# EAGLE design Status Board 0.4 (EAGLE 8.5.2)
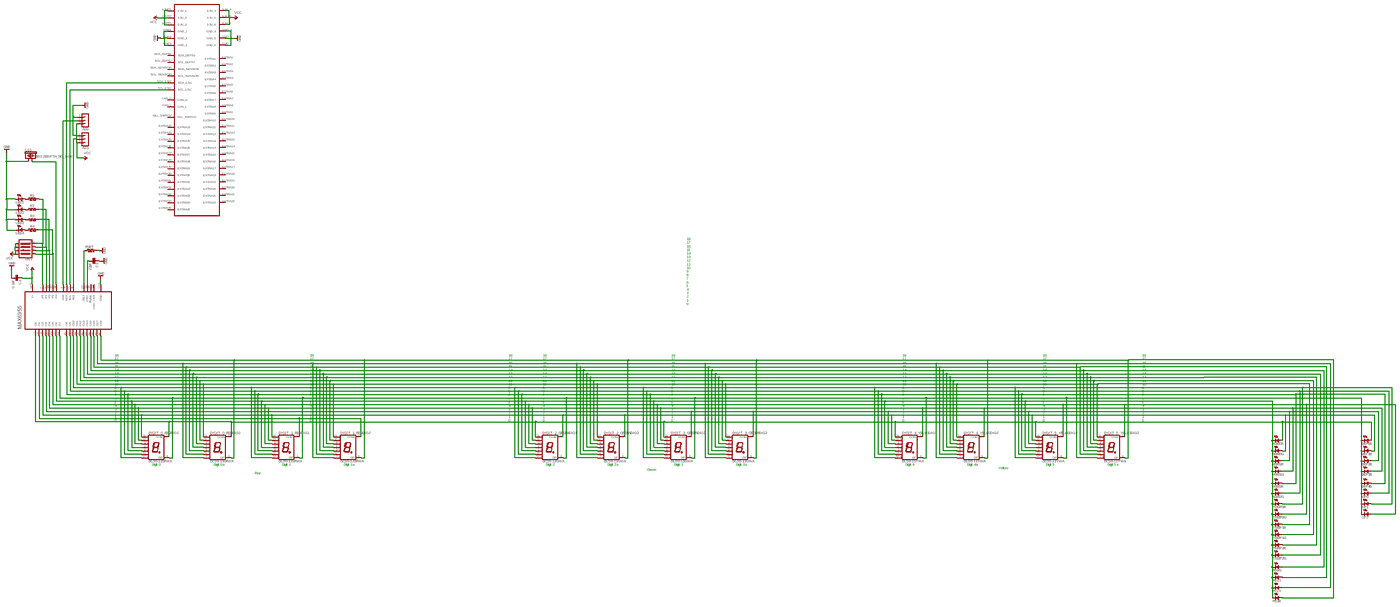
[diagram p0: schematic, sheet 1, overview]
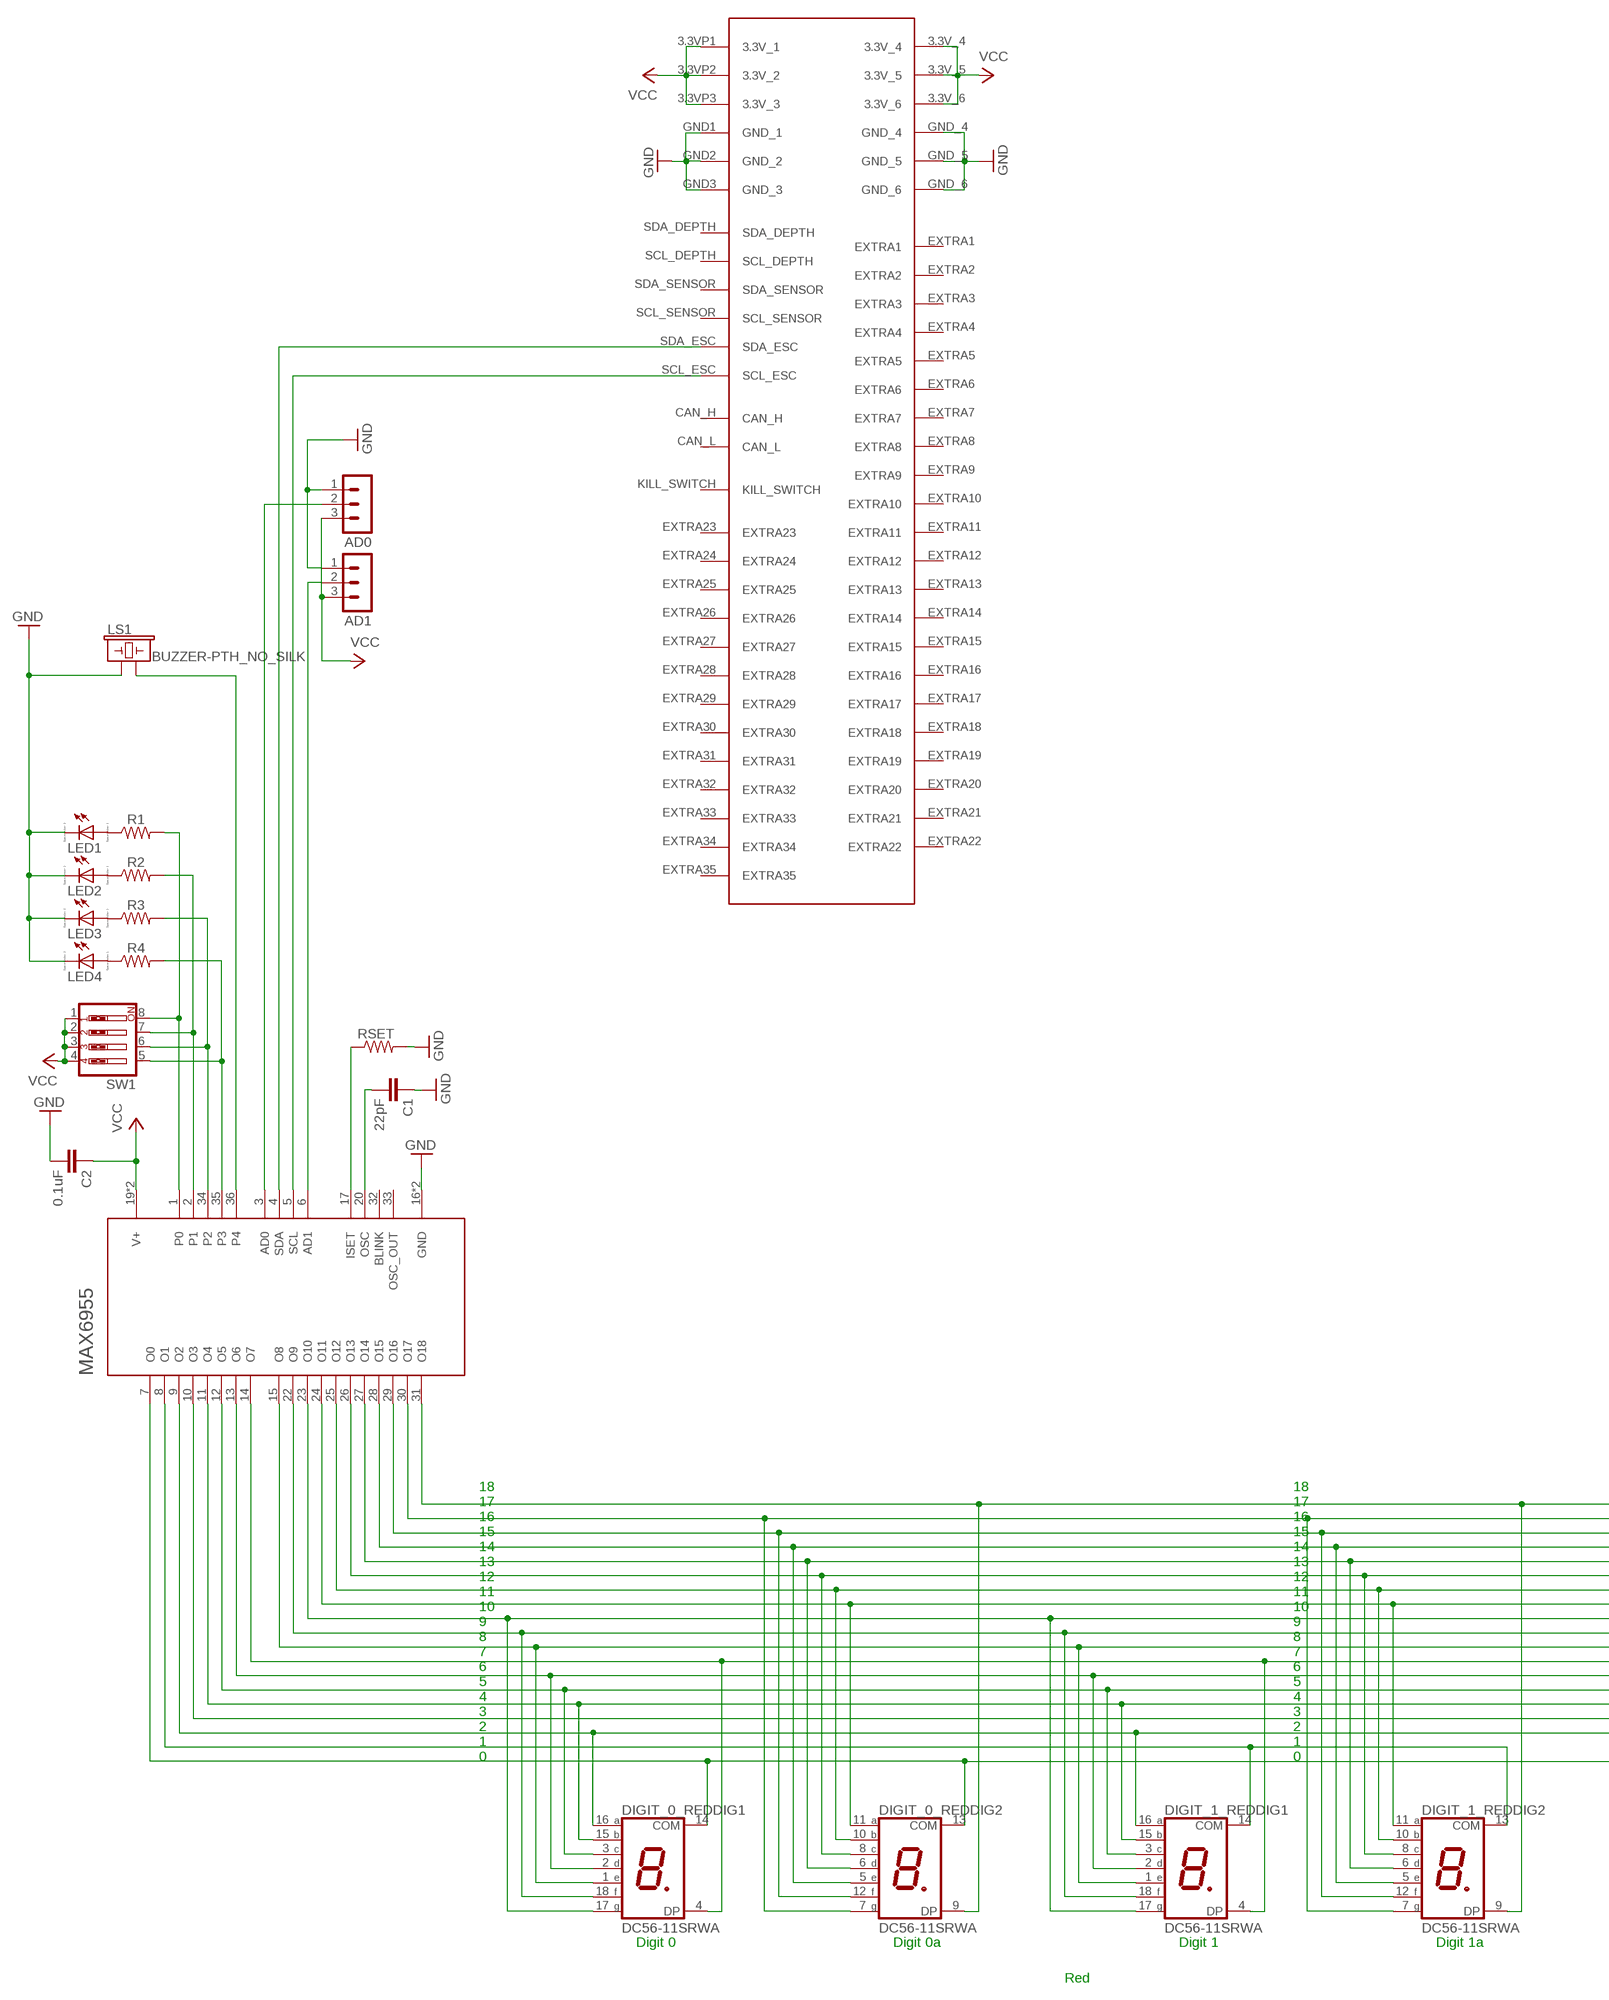
[diagram p1: schematic, sheet 1, part 1 of 4]
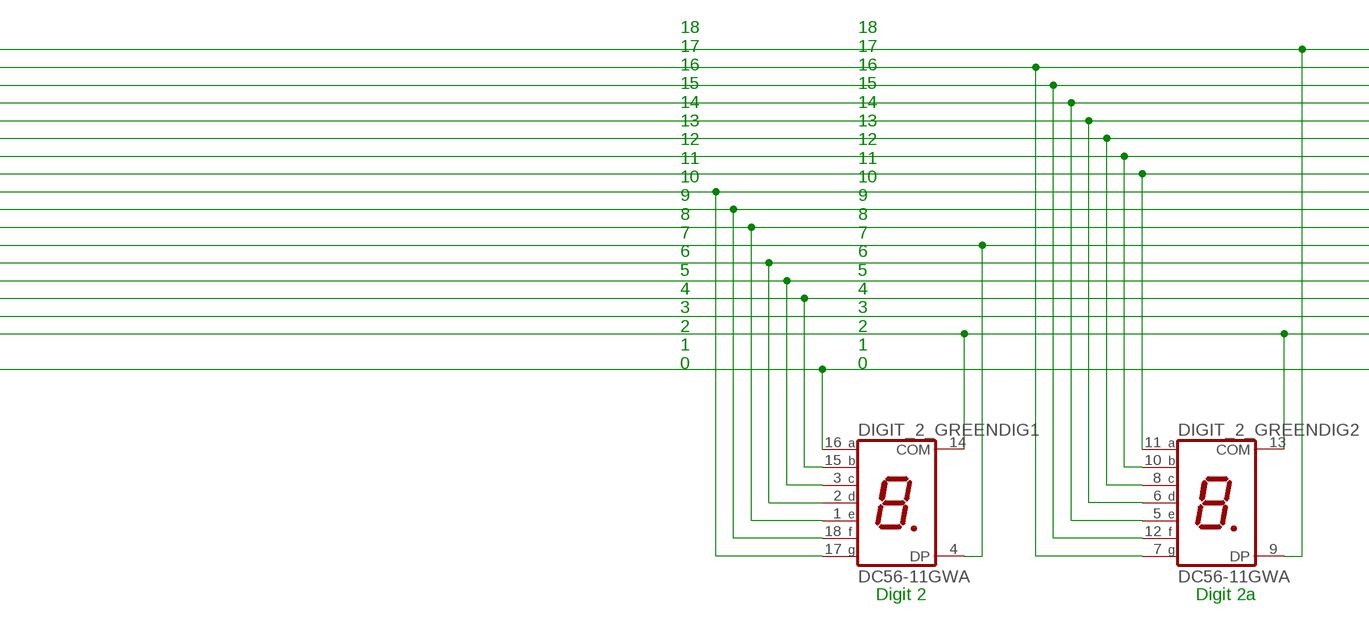
[diagram p2: schematic, sheet 1, part 2 of 4]
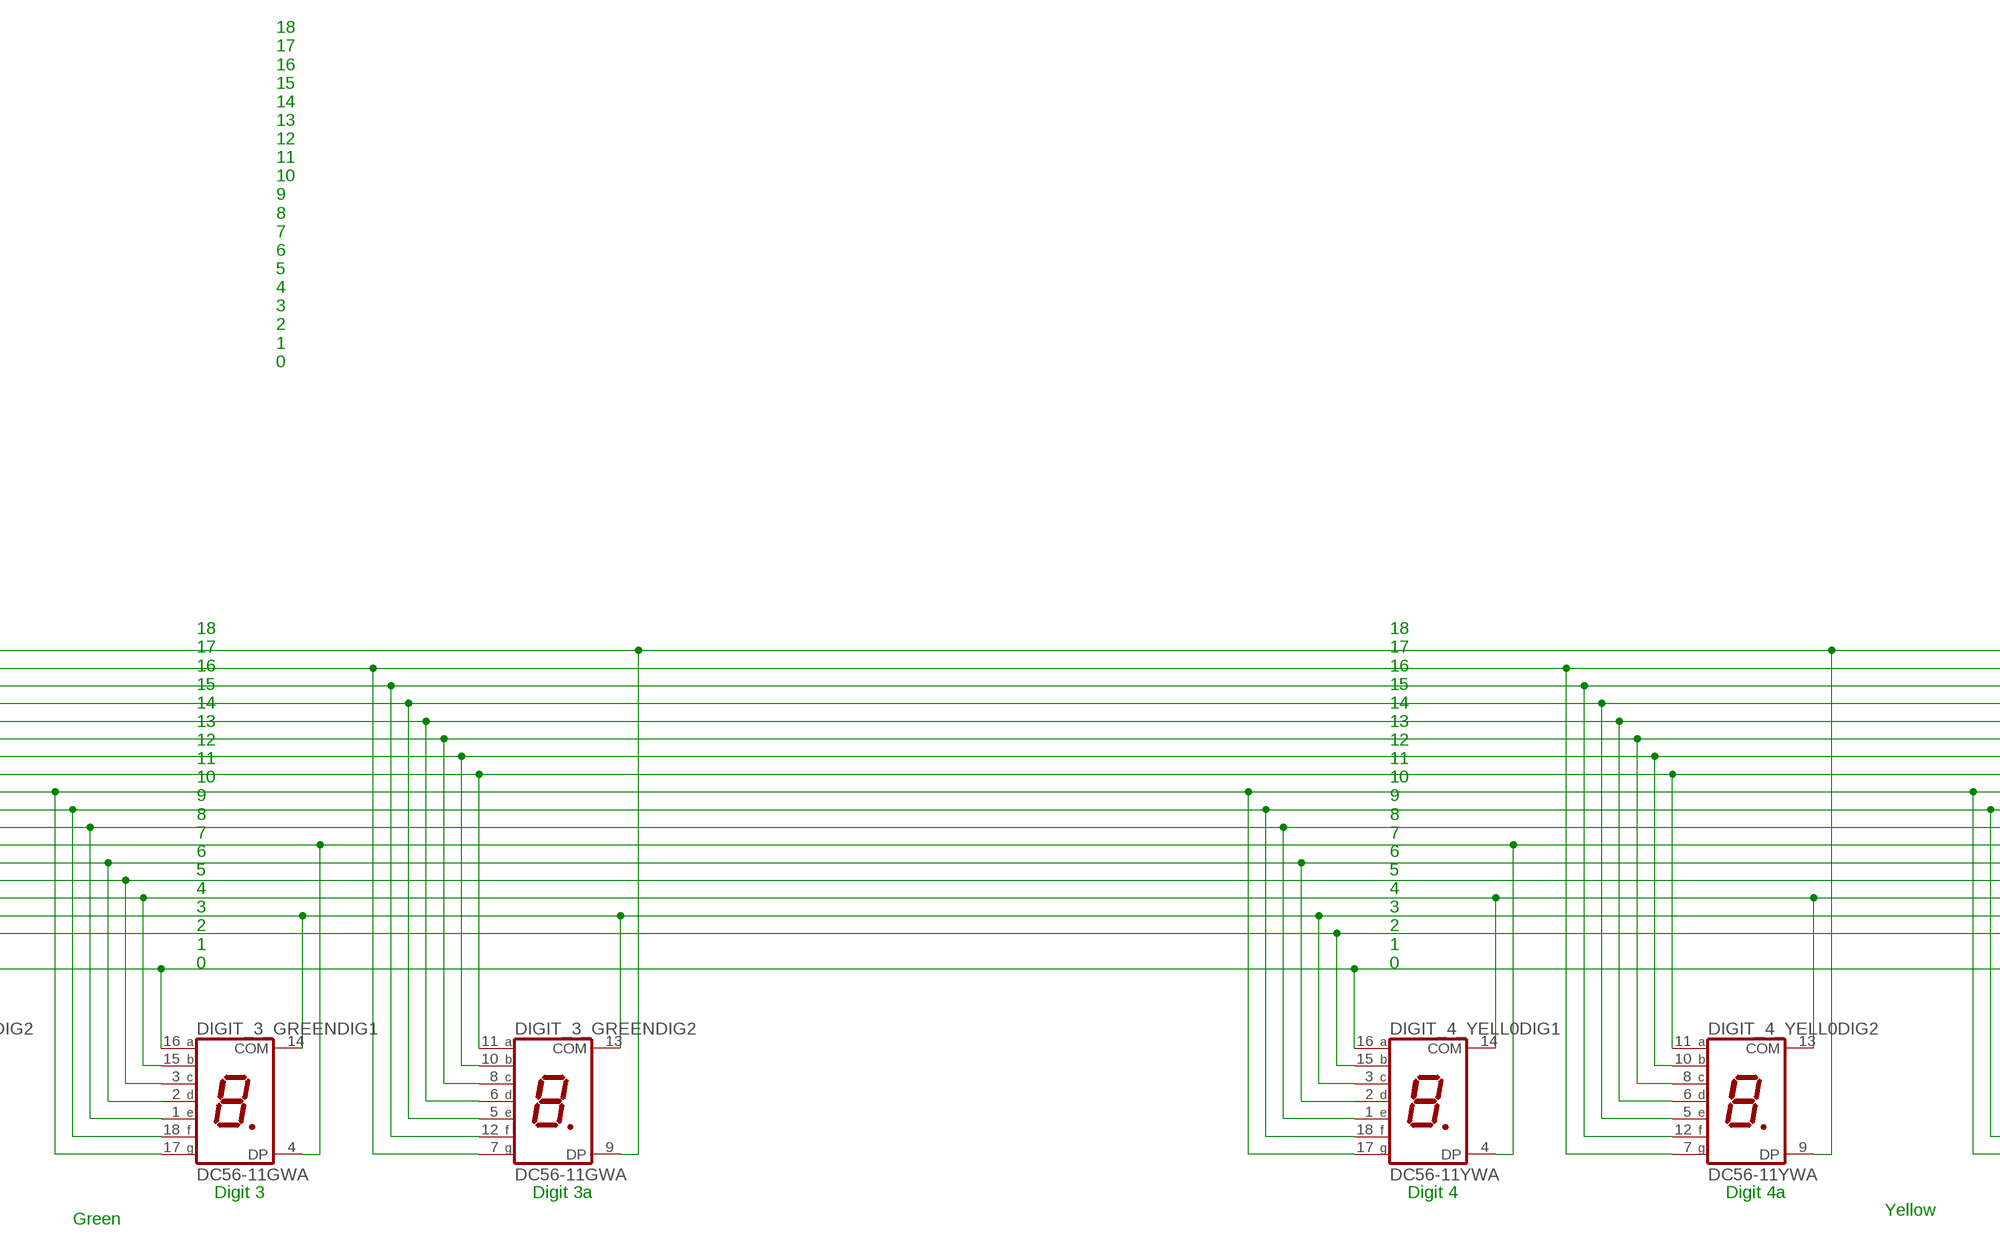
[diagram p3: schematic, sheet 1, part 3 of 4]
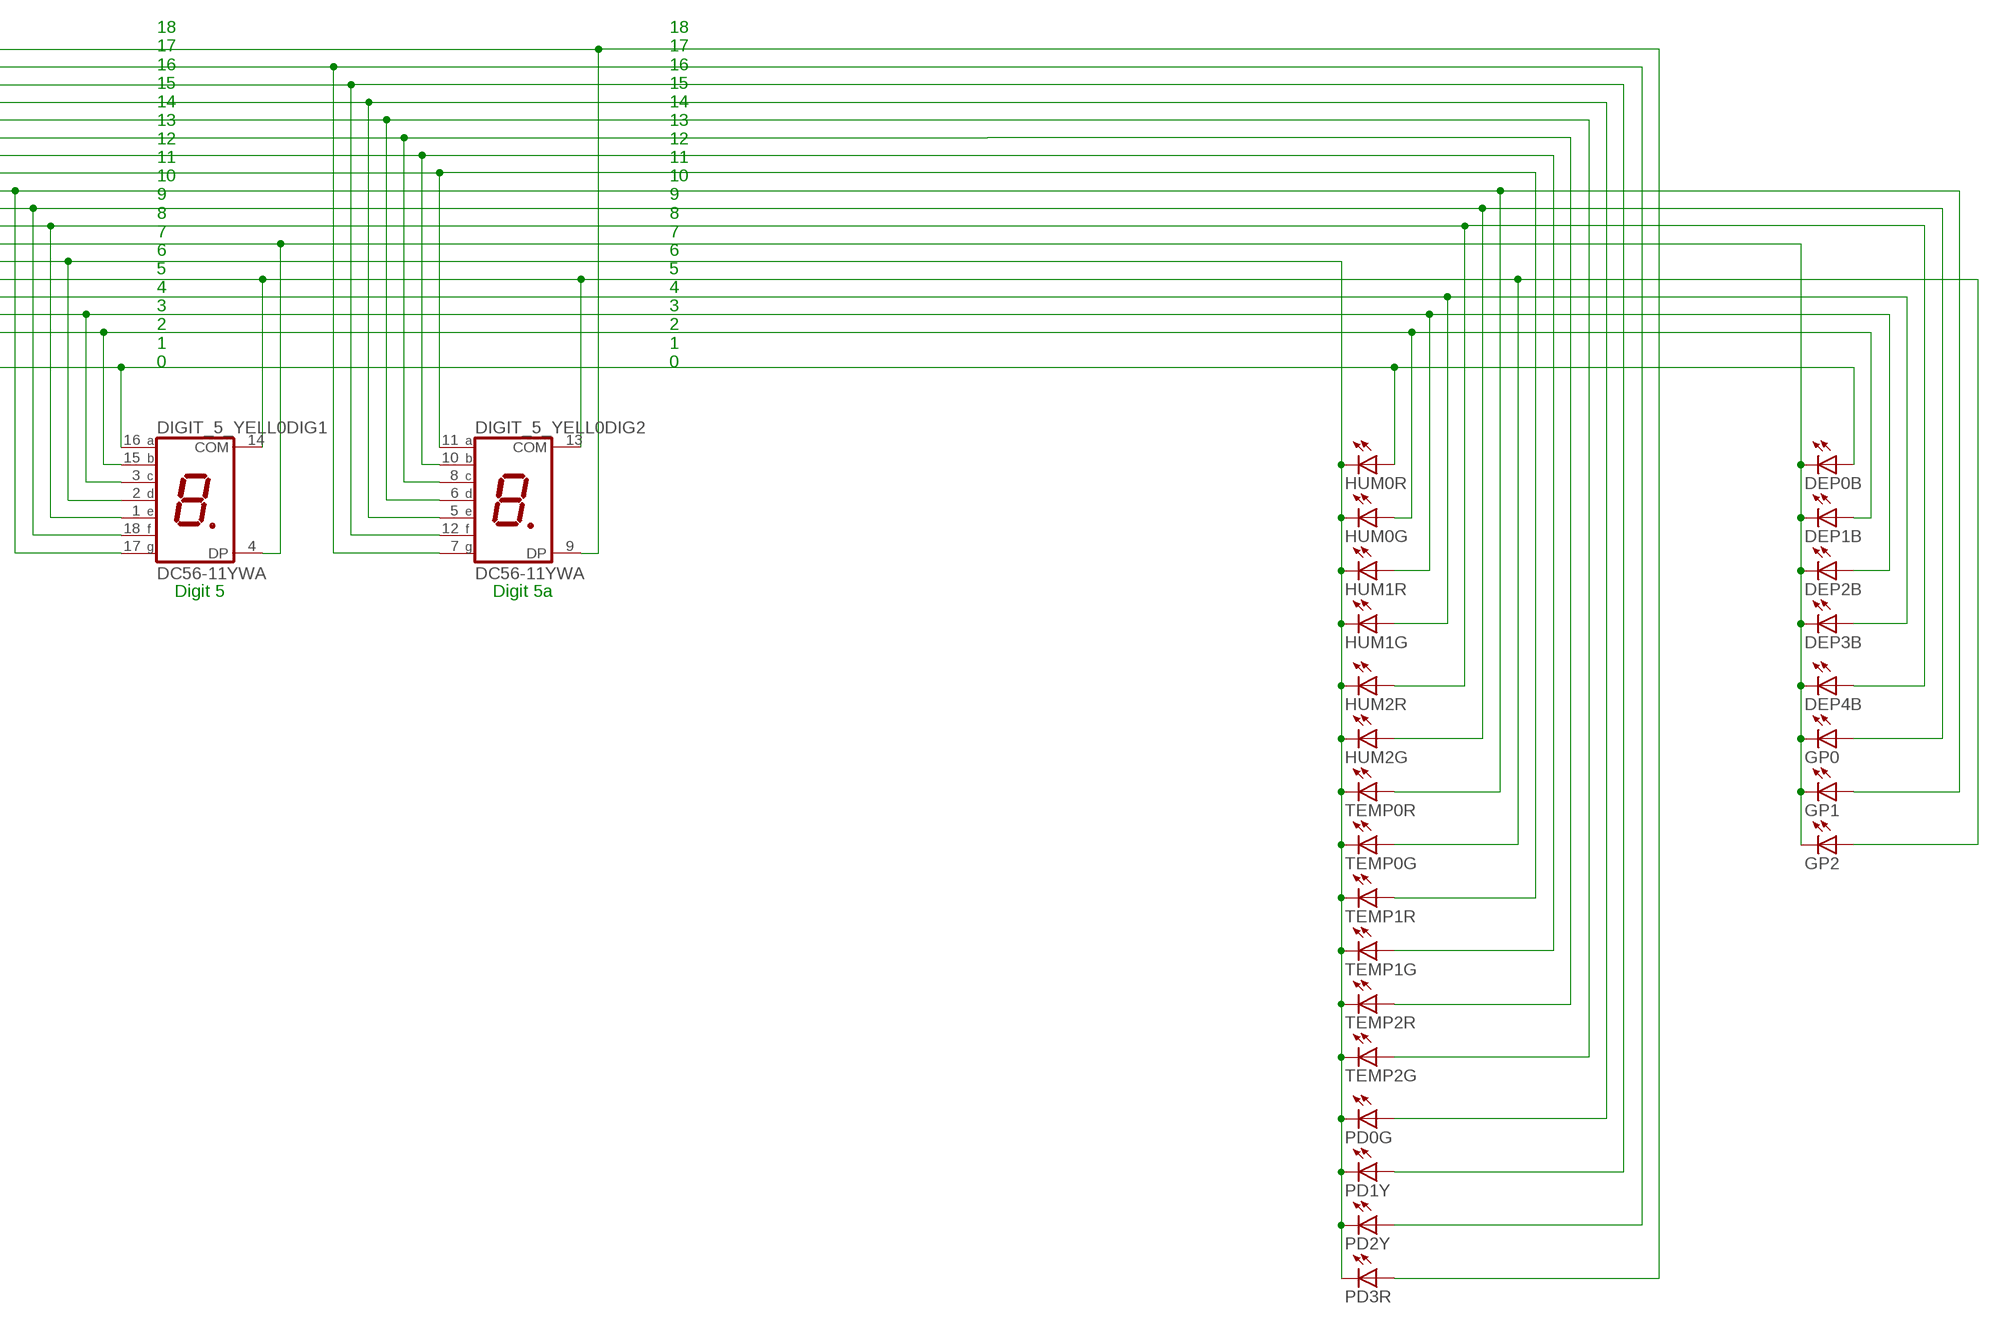
[diagram p4: schematic, sheet 1, part 4 of 4]

## Parts
AD0  MA03-1  [MA03-1]
AD1  MA03-1  [MA03-1]
C1  22pF  22PF-PTH-2.54MM-200V-5%  [CAP-PTH-2.54]
C2  0.1uF  0.1UF-KIT-EZ-50V-20%  [CAP-PTH-SMALL-KIT]
DEP0B  LED3MM  [LED3MM]
DEP1B  LED3MM  [LED3MM]
DEP2B  LED3MM  [LED3MM]
DEP3B  LED3MM  [LED3MM]
DEP4B  LED3MM  [LED3MM]
DIGIT_0_RED  DC56-11SRWA  [DA56]
DIGIT_1_RED  DC56-11SRWA  [DA56]
DIGIT_2_GREEN  DC56-11GWA  [DA56]
DIGIT_3_GREEN  DC56-11GWA  [DA56]
DIGIT_4_YELL0  DC56-11YWA  [DA56]
DIGIT_5_YELL0  DC56-11YWA  [DA56]
GP0  LED3MM  [LED3MM]
GP1  LED3MM  [LED3MM]
GP2  LED3MM  [LED3MM]
HUM0G  LED3MM  [LED3MM]
HUM0R  LED3MM  [LED3MM]
HUM1G  LED3MM  [LED3MM]
HUM1R  LED3MM  [LED3MM]
HUM2G  LED3MM  [LED3MM]
HUM2R  LED3MM  [LED3MM]
LED1  LED_ESML0603  [LED_SML0603]
LED2  LED_ESML0603  [LED_SML0603]
LED3  LED_ESML0603  [LED_SML0603]
LED4  LED_ESML0603  [LED_SML0603]
LS1  BUZZER-PTH_NO_SILK  [BUZZER-12MM-NS]
MAX6955  MAX6955  [SSOP36]
PD0G  LED3MM  [LED3MM]
PD1Y  LED3MM  [LED3MM]
PD2Y  LED3MM  [LED3MM]
PD3R  LED3MM  [LED3MM]
R1  68OHM-0603-1/10W-1%  [0603]
R2  68OHM-0603-1/10W-1%  [0603]
R3  68OHM-0603-1/10W-1%  [0603]
R4  68OHM-0603-1/10W-1%  [0603]
RSET  R-US_0207/12  [0207/12]
SW1  SW_DIP-4  [EDG-04]
TEMP0G  LED3MM  [LED3MM]
TEMP0R  LED3MM  [LED3MM]
TEMP1G  LED3MM  [LED3MM]
TEMP1R  LED3MM  [LED3MM]
TEMP2G  LED3MM  [LED3MM]
TEMP2R  LED3MM  [LED3MM]
U$2  5530843  [5530843-6-BOARDFINGERS]

## Nets
GND: AD0.1 AD1.1 C1.1 C2.2 LED1.C LED2.C LED3.C LED4.C LS1.+ MAX6955.16(GND) MAX6955.18(GND) RSET.2 U$2.GND1(GND_1) U$2.GND2(GND_2) U$2.GND3(GND_3) U$2.GND_4 U$2.GND_5 U$2.GND_6
N$1: LED1.A R1.1
N$2: MAX6955.5(SCL) U$2.SCL_ESC
N$3: LED2.A R2.1
N$4: MAX6955.1(P0) R1.2 SW1.8
N$5: MAX6955.2(P1) R2.2 SW1.7
N$6: MAX6955.34(P2) R3.2 SW1.6
N$7: MAX6955.35(P3) R4.2 SW1.5
N$8: LS1.- MAX6955.36(P4)
N$9: LED3.A R3.1
N$10: LED4.A R4.1
N$11: AD0.2 MAX6955.3(AD0)
N$12: AD1.2 MAX6955.6(AD1)
N$13: C1.2 MAX6955.20(OSC)
N$15: DEP4B.A DIGIT_0_RED.1(DIG1:E) DIGIT_1_RED.1(DIG1:E) DIGIT_2_GREEN.1(DIG1:E) DIGIT_3_GREEN.1(DIG1:E) DIGIT_4_YELL0.1(DIG1:E) DIGIT_5_YELL0.1(DIG1:E) HUM2R.A MAX6955.15(O8)
N$20: DEP0B.A DIGIT_0_RED.13(DIG2:COM) DIGIT_0_RED.14(DIG1:COM) DIGIT_2_GREEN.16(DIG1:A) DIGIT_3_GREEN.16(DIG1:A) DIGIT_4_YELL0.16(DIG1:A) DIGIT_5_YELL0.16(DIG1:A) HUM0R.A MAX6955.7(O0)
N$21: DIGIT_1_RED.13(DIG2:COM) DIGIT_1_RED.14(DIG1:COM) MAX6955.8(O1)
N$22: DEP1B.A DIGIT_0_RED.16(DIG1:A) DIGIT_1_RED.16(DIG1:A) DIGIT_2_GREEN.13(DIG2:COM) DIGIT_2_GREEN.14(DIG1:COM) DIGIT_4_YELL0.15(DIG1:B) DIGIT_5_YELL0.15(DIG1:B) HUM0G.A MAX6955.9(O2)
N$23: DEP2B.A DIGIT_3_GREEN.13(DIG2:COM) DIGIT_3_GREEN.14(DIG1:COM) DIGIT_4_YELL0.3(DIG1:C) DIGIT_5_YELL0.3(DIG1:C) HUM1R.A MAX6955.10(O3)
N$26: DEP3B.A DIGIT_0_RED.15(DIG1:B) DIGIT_1_RED.15(DIG1:B) DIGIT_2_GREEN.15(DIG1:B) DIGIT_3_GREEN.15(DIG1:B) DIGIT_4_YELL0.13(DIG2:COM) DIGIT_4_YELL0.14(DIG1:COM) HUM1G.A MAX6955.11(O4)
N$27: DIGIT_0_RED.3(DIG1:C) DIGIT_1_RED.3(DIG1:C) DIGIT_2_GREEN.3(DIG1:C) DIGIT_3_GREEN.3(DIG1:C) DIGIT_5_YELL0.13(DIG2:COM) DIGIT_5_YELL0.14(DIG1:COM) GP2.A MAX6955.12(O5) TEMP0G.A
N$29: DIGIT_0_RED.18(DIG1:F) DIGIT_1_RED.18(DIG1:F) DIGIT_2_GREEN.18(DIG1:F) DIGIT_3_GREEN.18(DIG1:F) DIGIT_4_YELL0.18(DIG1:F) DIGIT_5_YELL0.18(DIG1:F) GP0.A HUM2G.A MAX6955.22(O9)
N$30: DIGIT_0_RED.17(DIG1:G) DIGIT_1_RED.17(DIG1:G) DIGIT_2_GREEN.17(DIG1:G) DIGIT_3_GREEN.17(DIG1:G) DIGIT_4_YELL0.17(DIG1:G) DIGIT_5_YELL0.17(DIG1:G) GP1.A MAX6955.23(O10) TEMP0R.A
N$31: DIGIT_0_RED.11(DIG2:A) DIGIT_1_RED.11(DIG2:A) DIGIT_2_GREEN.11(DIG2:A) DIGIT_3_GREEN.11(DIG2:A) DIGIT_4_YELL0.11(DIG2:A) DIGIT_5_YELL0.11(DIG2:A) MAX6955.24(O11) TEMP1R.A
N$32: DIGIT_0_RED.10(DIG2:B) DIGIT_1_RED.10(DIG2:B) DIGIT_2_GREEN.10(DIG2:B) DIGIT_3_GREEN.10(DIG2:B) DIGIT_4_YELL0.10(DIG2:B) DIGIT_5_YELL0.10(DIG2:B) MAX6955.25(O12) TEMP1G.A
N$33: DIGIT_0_RED.2(DIG1:D) DIGIT_1_RED.2(DIG1:D) DIGIT_2_GREEN.2(DIG1:D) DIGIT_3_GREEN.2(DIG1:D) DIGIT_4_YELL0.2(DIG1:D) DIGIT_5_YELL0.2(DIG1:D) HUM0G.K(C) HUM0R.K(C) HUM1G.K(C) HUM1R.K(C) HUM2G.K(C) HUM2R.K(C) MAX6955.13(O6) PD0G.K(C) PD1Y.K(C) PD2Y.K(C) PD3R.K(C) TEMP0G.K(C) TEMP0R.K(C) TEMP1G.K(C) TEMP1R.K(C) TEMP2G.K(C) TEMP2R.K(C)
N$34: DIGIT_0_RED.6(DIG2:D) DIGIT_1_RED.6(DIG2:D) DIGIT_2_GREEN.6(DIG2:D) DIGIT_3_GREEN.6(DIG2:D) DIGIT_4_YELL0.6(DIG2:D) DIGIT_5_YELL0.6(DIG2:D) MAX6955.27(O14) TEMP2G.A
N$35: DIGIT_0_RED.5(DIG2:E) DIGIT_1_RED.5(DIG2:E) DIGIT_2_GREEN.5(DIG2:E) DIGIT_3_GREEN.5(DIG2:E) DIGIT_4_YELL0.5(DIG2:E) DIGIT_5_YELL0.5(DIG2:E) MAX6955.28(O15) PD0G.A
N$36: DIGIT_0_RED.12(DIG2:F) DIGIT_1_RED.12(DIG2:F) DIGIT_2_GREEN.12(DIG2:F) DIGIT_3_GREEN.12(DIG2:F) DIGIT_4_YELL0.12(DIG2:F) DIGIT_5_YELL0.12(DIG2:F) MAX6955.29(O16) PD1Y.A
N$37: DIGIT_0_RED.7(DIG2:G) DIGIT_1_RED.7(DIG2:G) DIGIT_2_GREEN.7(DIG2:G) DIGIT_3_GREEN.7(DIG2:G) DIGIT_4_YELL0.7(DIG2:G) DIGIT_5_YELL0.7(DIG2:G) MAX6955.30(O17) PD2Y.A
N$38: DIGIT_0_RED.9(DIG2:DP) DIGIT_1_RED.9(DIG2:DP) DIGIT_2_GREEN.9(DIG2:DP) DIGIT_3_GREEN.9(DIG2:DP) DIGIT_4_YELL0.9(DIG2:DP) DIGIT_5_YELL0.9(DIG2:DP) MAX6955.31(O18) PD3R.A
N$40: DIGIT_0_RED.8(DIG2:C) DIGIT_1_RED.8(DIG2:C) DIGIT_2_GREEN.8(DIG2:C) DIGIT_3_GREEN.8(DIG2:C) DIGIT_4_YELL0.8(DIG2:C) DIGIT_5_YELL0.8(DIG2:C) MAX6955.26(O13) TEMP2R.A
N$43: MAX6955.4(SDA) U$2.SDA_ESC
N$46: MAX6955.17(ISET) RSET.1
N$56: DEP0B.K(C) DEP1B.K(C) DEP2B.K(C) DEP3B.K(C) DEP4B.K(C) DIGIT_0_RED.4(DIG1:DP) DIGIT_1_RED.4(DIG1:DP) DIGIT_2_GREEN.4(DIG1:DP) DIGIT_3_GREEN.4(DIG1:DP) DIGIT_4_YELL0.4(DIG1:DP) DIGIT_5_YELL0.4(DIG1:DP) GP0.K(C) GP1.K(C) GP2.K(C) MAX6955.14(O7)
VCC: AD0.3 AD1.3 C2.1 MAX6955.19(V+) MAX6955.21(V+) SW1.1 SW1.2 SW1.3 SW1.4 U$2.3.3V_4 U$2.3.3V_5 U$2.3.3V_6 U$2.3.3VP1(3.3V_1) U$2.3.3VP2(3.3V_2) U$2.3.3VP3(3.3V_3)
Unconnected: MAX6955.32(BLINK) MAX6955.33(OSC_OUT) U$2.CAN_H U$2.CAN_L U$2.EXTRA1 U$2.EXTRA2 U$2.EXTRA3 U$2.EXTRA4 U$2.EXTRA5 U$2.EXTRA6 U$2.EXTRA7 U$2.EXTRA8 U$2.EXTRA9 U$2.EXTRA10 U$2.EXTRA11 U$2.EXTRA12 U$2.EXTRA13 U$2.EXTRA14 U$2.EXTRA15 U$2.EXTRA16 U$2.EXTRA17 U$2.EXTRA18 U$2.EXTRA19 U$2.EXTRA20 U$2.EXTRA21 U$2.EXTRA22 U$2.EXTRA23 U$2.EXTRA24 U$2.EXTRA25 U$2.EXTRA26 U$2.EXTRA27 U$2.EXTRA28 U$2.EXTRA29 U$2.EXTRA30 U$2.EXTRA31 U$2.EXTRA32 U$2.EXTRA33 U$2.EXTRA34 U$2.EXTRA35 U$2.KILL_SWITCH U$2.SCL_DEPTH U$2.SCL_SENSOR U$2.SDA_DEPTH U$2.SDA_SENSOR

## Notes on the sheet
- 18
  17
  16
  15
  14
  13
  12
  11
  10
  9
  8
  7
  6
  5
  4
  3
  2
  1
  0
- 18
  17
  16
  15
  14
  13
  12
  11
  10
  9
  8
  7
  6
  5
  4
  3
  2
  1
  0
- 18
  17
  16
  15
  14
  13
  12
  11
  10
  9
  8
  7
  6
  5
  4
  3
  2
  1
  0
- 18
  17
  16
  15
  14
  13
  12
  11
  10
  9
  8
  7
  6
  5
  4
  3
  2
  1
  0
- 18
  17
  16
  15
  14
  13
  12
  11
  10
  9
  8
  7
  6
  5
  4
  3
  2
  1
  0
- 18
  17
  16
  15
  14
  13
  12
  11
  10
  9
  8
  7
  6
  5
  4
  3
  2
  1
  0
- 18
  17
  16
  15
  14
  13
  12
  11
  10
  9
  8
  7
  6
  5
  4
  3
  2
  1
  0
- 18
  17
  16
  15
  14
  13
  12
  11
  10
  9
  8
  7
  6
  5
  4
  3
  2
  1
  0
- 18
  17
  16
  15
  14
  13
  12
  11
  10
  9
  8
  7
  6
  5
  4
  3
  2
  1
  0
- Digit 0 | Digit 0a | Digit 1 | Digit 1a | Digit 2 | Digit 2a | Digit 3 | Digit 3a | Digit 4 | Digit 4a | Digit 5 | Digit 5a
- Yellow
- Green
- Red

## Library data of the parts
AD0 AD1 = con-lstb:MA03-1: PIN HEADER; OC_FARNELL: unknown; OC_NEWARK: unknown
C1 = SparkFun-Capacitors:22PF: 22pF ceramic capacitors A capacitor is a passive two-terminal electrical component used to store electrical energy temporarily in an electric field.; PROD_ID: CAP-09128
C2 = SparkFun-Capacitors:0.1UF: 0.1µF ceramic capacitors A capacitor is a passive two-terminal electrical component used to store electrical energy temporarily in an electric field.; PROD_ID: CAP-08370
DEP0B DEP1B DEP2B DEP3B DEP4B GP0 GP1 GP2 HUM0G HUM0R HUM1G HUM1R HUM2G HUM2R PD0G PD1Y PD2Y PD3R TEMP0G TEMP0R TEMP1G TEMP1R TEMP2G TEMP2R = led:LED: LED OSRAM: - CHIPLED LG R971, LG N971, LY N971, LG Q971, LY Q971, LO R971, LY R971 LH N974, LH R974 LS Q976, LO Q976, LY Q976 LO Q996 - Hyper CHIPLED LW Q18S LB Q993, LB Q99A, LB R99A - SideLED LS A670, LO A670, LY A670, LG A670, LP A670 LB A673, LV A673, LT A673, LW A673 LH A674 LY A675 LS A676, LA A676, LO A676, LY A676, LW A676 LS A679, LY A679, LG A679 - Hyper Micro SIDELED® LS Y876, LA Y876, LO Y876, LY Y876 LT Y87S - SmartLED LW L88C, LW L88S LB L89C, LB L89S, LG L890 LS L89K, LO L89K, LY L89K LS L896, LA L896, LO L896, LY L896 - TOPLED LS T670, LO T670, LY T670, LG T670, LP T670 LSG T670, LSP T670, LSY T670, LOP T670, LYG T670 LG T671, LOG T671, LSG T671 LB T673, LV T673, LT T673, LW T673 LH T674 LS T676, LA T676, LO T676, LY T676, LB T676, LH T676, LSB T676, LW T676 LB T67C, LV T67C, LT T67C, LS T67K, LO T67K, LY T67K, LW E67C LS E67B, LA E67B, LO E67B, LY E67B, LB E67C, LV E67C, LT E67C LW T67C LS T679, LY T679, LG T679 LS T770, LO T770, LY T770, LG T770, LP T770 LB T773, LV T773, LT T773, LW T773 LH T774 LS E675, LA E675, LY E675, LS T675 LS T776, LA T776, LO T776, LY T776, LB T776 LHGB T686 LT T68C, LB T68C - Hyper Mini TOPLED® LB M676 - Mini TOPLED Santana® LG M470 LS M47K, LO M47K, LY M47K Source: http://www.osram.convergy.de LUXEON: - LUMILED® LXK2-PW12-R00, LXK2-PW12-S00, LXK2-PW14-U00, LXK2-PW14-V00 LXK2-PM12-R00, LXK2-PM12-S00, LXK2-PM14-U00 LXK2-PE12-Q00, LXK2-PE12-R00, LXK2-PE12-S00, LXK2-PE14-T00, LXK2-PE14-U00 LXK2-PB12-K00, LXK2-PB12-L00, LXK2-PB12-M00, LXK2-PB14-N00, LXK2-PB14-P00, LXK2-PB14-Q00 LXK2-PR12-L00, LXK2-PR12-M00, LXK2-PR14-Q00, LXK2-PR14-R00 LXK2-PD12-Q00, LXK2-PD12-R00, LXK2-PD12-S00 LXK2-PH12-R00, LXK2-PH12-S00 LXK2-PL12-P00, LXK2-PL12-Q00, LXK2-PL12-R00 Source: www.luxeon.com KINGBRIGHT: KA-3528ASYC Source: www.kingbright.com
DIGIT_0_RED DIGIT_1_RED DIGIT_2_GREEN DIGIT_3_GREEN DIGIT_4_YELL0 DIGIT_5_YELL0 = display-kingbright:DC56-11: 14.22mm (0.56INCH) DUAL DIGIT NUMERIC DISPLAYS Source: www.kingbright.com .. DA56-11SRWA.pdf; OC_FARNELL: unknown; OC_NEWARK: unknown
LED1-LED4 = eagle-ltspice:LED_E: LED Source: http://www.osram.convergy.de Source: www.luxeon.com Source: www.kingbright.com; SPICEMODEL: NONE; SPICEPREFIX: D; SPICETYPE: diode
LS1 = Buzzer-AI-1223-TWT-3V-2-R:BUZZER: Buzzer Small round buzzers that operate around the audible 2kHz range. You can use these as speakers to create simple music or user interfaces. Variant Overview: PTH - Mini Speaker - PC Mount 12mm 2.048kHz <https://www.sparkfun.com/products/7950> PTH_KIT - Mini Speaker - PC Mount 12mm 2.048kHz <https://www.sparkfun.com/products/7950> KIT simplifies soldering by adding stop mask to one side of the pads. PTH_NO_SILK - Mini Speaker - PC Mount 12mm 2.048kHz <https://www.sparkfun.com/products/7950> No silkscreen indicator of buzzer outline. PTH_KIT_NO_SILK - Mini Speaker - PC Mount 12mm 2.048kHz <https://www.sparkfun.com/products/7950> KIT package w/o silkscreen SMD - Buzzer Audio Magnetic (CCV-084B16) SMD buzzer used on, e.g. the LilyPad Buzzer <https://www.sparkfun.com/products/8463> and RFID USB Reader <https://www.sparkfun.com/products/9963>. SMD_KIT - Buzzer Audio Magnetic (CCV-084B16) SMD Buzzer with elongated pins to make soldering easier. Used on the SparkFun Simon Says - Surface Mount Soldering Kit <https://www.sparkfun.com/products/10935>.; PROD_ID: COMP-08253; SF_SKU: COM-07950
MAX6955 = MAX6955:MAX6955
R1-R4 = SparkFun-Resistors:68OHM: 68Ω resistor A resistor is a passive two-terminal electrical component that implements electrical resistance as a circuit element. Resistors act to reduce current flow, and, at the same time, act to lower voltage levels within circuits. - Wikipedia
RSET = resistor:R-US_: RESISTOR, American symbol
SW1 = special:SW_DIP-4: DIP SWITCH
U$2 = 5530843-6:5530843

## Board
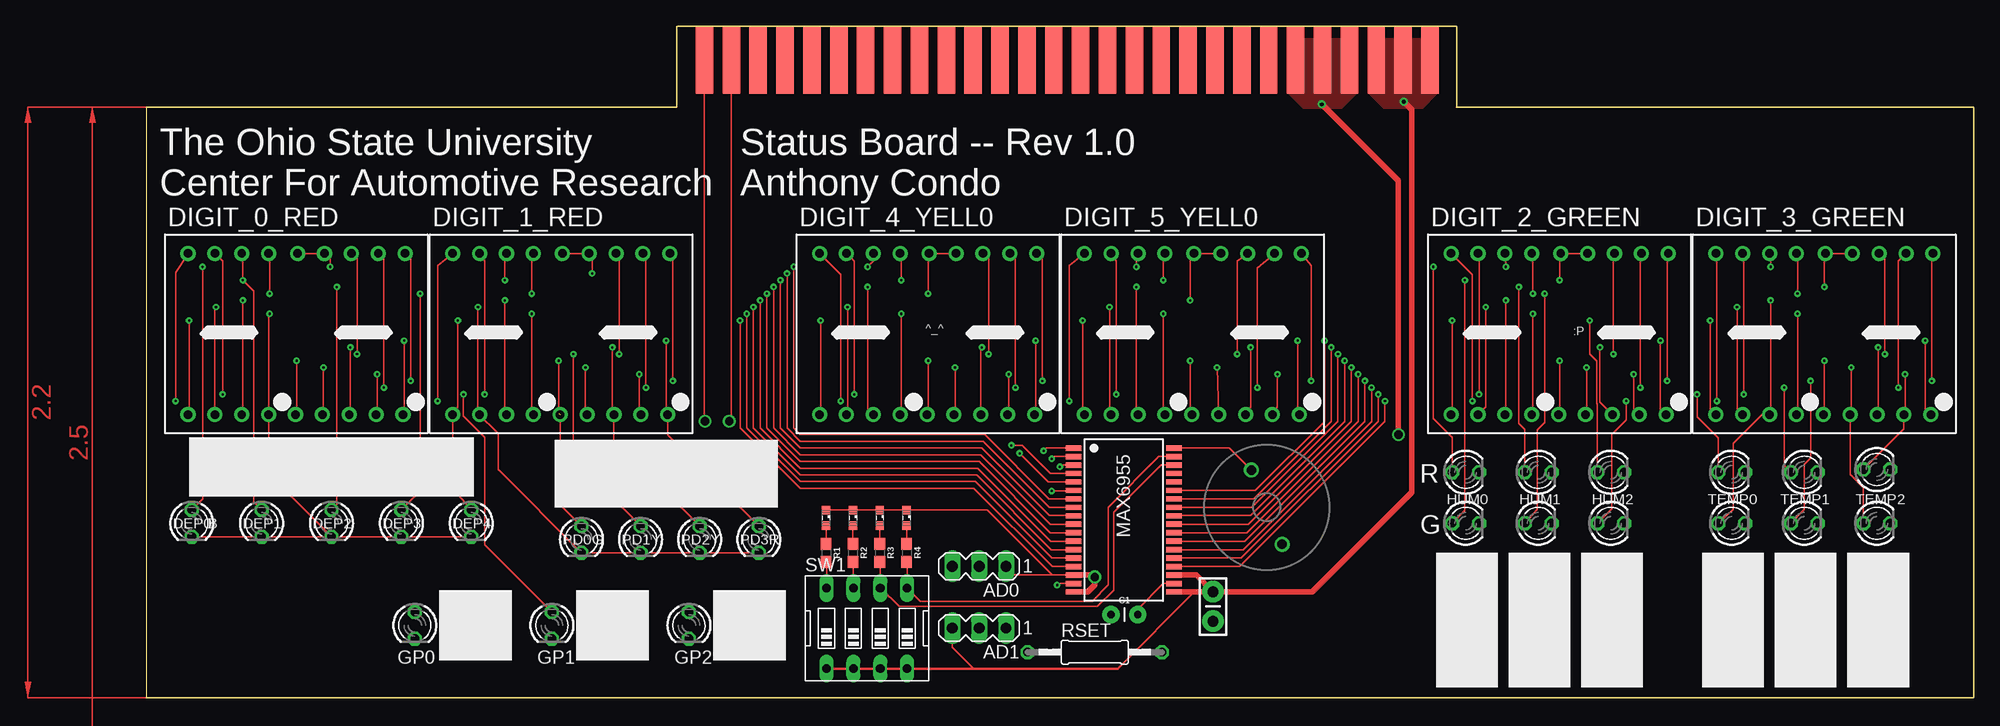
[diagram p5: board, top side]
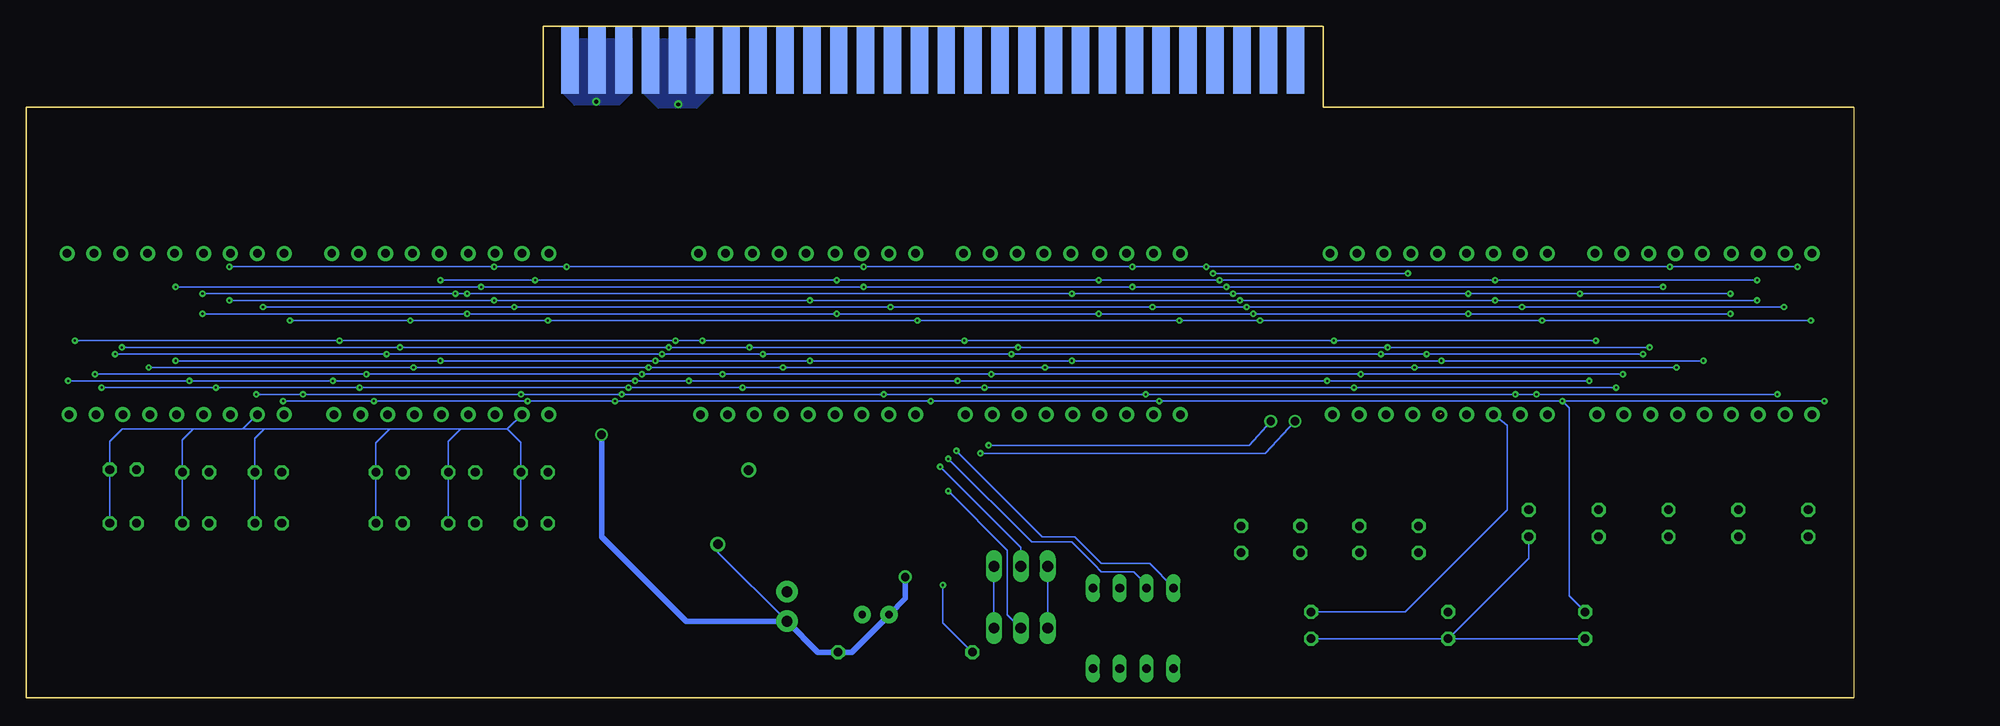
[diagram p6: board, bottom side, seen from below]

Size 172.72 x 63.5 mm. Coordinates in mm from the lower left corner, seen from the top.
Outline: 50.16,55.88 0,55.88 0,0 172.72,0 172.72,55.88 123.83,55.88
Copper layers (1*16): Top 0.035mm / dielectric 1.5mm / Bottom 0.035mm
Design rules "default": minimum track width 6mil, minimum drill 0.35mm, track to track 6mil, track to pad 6mil, pad to pad 6mil, via to via 6mil, smd to smd 6mil, copper to edge 40mil, drill to drill 6mil, minimum pad ring 10mil, minimum via ring 8mil, stop-mask expansion 4mil, vias tented up to drill 0mil, thermal gap 10mil

### Footprints (pad centres in the part's own frame; a part is rotated, then mirrored left to right if it is on the bottom)
MA03-1 = drill 1.016 long: 1 -2.54,0; 2 0,0; 3 2.54,0
CAP-PTH-2.54 = drill 0.7 pad 1.651: 1 -1.27,0; 2 1.27,0
CAP-PTH-SMALL-KIT = drill 1.016 pad 2.032: 1 -1.397,0; 2 1.397,0
LED3MM = drill 0.813 octagon: A -1.27,0; K 1.27,0
DA56 = drill 0.8 pad 1.422: 1 -10.26,-7.62; 2 -7.72,-7.62; 3 -5.18,-7.62; 4 -2.64,-7.62; 5 -0.1,-7.62; 6 2.44,-7.62; 7 4.98,-7.62; 8 7.52,-7.62; 9 10.06,-7.62; 10 10.26,7.62; 11 7.72,7.62; 12 5.18,7.62; 13 2.64,7.62; 14 0.1,7.62; 15 -2.64,7.62; 16 -5.18,7.62; 17 -7.72,7.62; 18 -10.26,7.62
LED_SML0603 = smd 0.8 x 0.8: A 0.75,0; C -0.75,0
BUZZER-12MM-NS = drill 0.9: + 3.8,0; - -3.8,0
SSOP36 = smd 0.5 x 1.5: 1 -6.8,-4.75; 2 -6,-4.75; 3 -5.2,-4.75; 4 -4.4,-4.75; 5 -3.6,-4.75; 6 -2.8,-4.75; 7 -2,-4.75; 8 -1.2,-4.75; 9 -0.4,-4.75; 10 0.4,-4.75; 11 1.2,-4.75; 12 2,-4.75; 13 2.8,-4.75; 14 3.6,-4.75; 15 4.4,-4.75; 16 5.2,-4.75; 17 6,-4.75; 18 6.8,-4.75; 19 6.8,4.75; 20 6,4.75; 21 5.2,4.75; 22 4.4,4.75; 23 3.6,4.75; 24 2.8,4.75; 25 2,4.75; 26 1.2,4.75; 27 0.4,4.75; 28 -0.4,4.75; 29 -1.2,4.75; 30 -2,4.75; 31 -2.8,4.75; 32 -3.6,4.75; 33 -4.4,4.75; 34 -5.2,4.75; 35 -6,4.75; 36 -6.8,4.75
0603 = smd 1.1 x 1: 1 -0.85,0; 2 0.85,0
0207/12 = drill 0.813 octagon: 1 -6.35,0; 2 6.35,0
EDG-04 = drill 0.813 long: 1 -3.81,-3.81; 2 -1.27,-3.81; 3 1.27,-3.81; 4 3.81,-3.81; 5 3.81,3.81; 6 1.27,3.81; 7 -1.27,3.81; 8 -3.81,3.81
5530843-6-BOARDFINGERS = smd 1.651 x 6.35 bottom: 3.3V_4 0.826,3.175; 3.3V_5 3.365,3.175; 3.3V_6 5.905,3.175; EXTRA1 16.066,3.175; EXTRA2 18.605,3.175; EXTRA3 21.145,3.175; EXTRA4 23.686,3.175; EXTRA5 26.226,3.175; EXTRA6 28.765,3.175; EXTRA7 31.305,3.175; EXTRA8 33.846,3.175; EXTRA9 36.386,3.175; EXTRA10 38.925,3.175; EXTRA11 41.465,3.175; EXTRA12 44.005,3.175; EXTRA13 46.545,3.175; EXTRA14 49.086,3.175; EXTRA15 51.626,3.175; EXTRA16 54.166,3.175; EXTRA17 56.706,3.175; EXTRA18 59.245,3.175; EXTRA19 61.785,3.175; EXTRA20 64.326,3.175; EXTRA21 66.865,3.175; EXTRA22 69.406,3.175; GND_4 8.445,3.175; GND_5 10.986,3.175; GND_6 13.525,3.175 | smd 1.651 x 6.35: 3.3VP1 0.826,3.175; 3.3VP2 3.365,3.175; 3.3VP3 5.905,3.175; CAN_H 51.626,3.175; CAN_L 54.166,3.175; EXTRA23 16.066,3.175; EXTRA24 18.605,3.175; EXTRA25 21.145,3.175; EXTRA26 23.686,3.175; EXTRA27 26.226,3.175; EXTRA28 28.765,3.175; EXTRA29 31.305,3.175; EXTRA30 33.846,3.175; EXTRA31 36.386,3.175; EXTRA32 38.925,3.175; EXTRA33 41.465,3.175; EXTRA34 44.005,3.175; EXTRA35 46.545,3.175; GND1 8.445,3.175; GND2 10.986,3.175; GND3 13.525,3.175; KILL_SWITCH 49.086,3.175; SCL_DEPTH 59.245,3.175; SCL_ESC 69.406,3.175; SCL_SENSOR 64.326,3.175; SDA_DEPTH 56.706,3.175; SDA_ESC 66.865,3.175; SDA_SENSOR 61.785,3.175

### Placement (x,y rotation side)
AD0  78.74,12.45 180 top
AD1  78.74,6.6 180 top
C1  92.46,7.87 0 top
C2  100.84,8.64 270 top
DEP0B  4.32,16.51 270 top
DEP1B  10.92,16.51 270 top
DEP2B  17.53,16.51 270 top
DEP3B  24.13,16.51 270 top
DEP4B  30.73,16.51 270 top
DIGIT_0_RED  14.22,34.42 0 top
DIGIT_1_RED  39.24,34.42 0 top
DIGIT_2_GREEN  133.6,34.42 0 top
DIGIT_3_GREEN  158.62,34.42 0 top
DIGIT_4_YELL0  73.91,34.42 0 top
DIGIT_5_YELL0  98.93,34.42 0 top
GP0  25.4,6.86 270 top
GP1  38.35,6.86 270 top
GP2  51.31,6.86 270 top
HUM0G  124.71,16.51 0 top
HUM0R  124.71,21.34 0 top
HUM1G  131.57,16.51 0 top
HUM1R  131.57,21.34 0 top
HUM2G  138.43,16.51 0 top
HUM2R  138.43,21.34 0 top
LED1  64.26,17.02 270 top
LED2  66.8,17.02 270 top
LED3  69.34,17.02 270 top
LED4  71.88,17.02 270 top
LS1  105.92,18.03 292.5 top
MAX6955  92.41,16.81 270 top
PD0G  41.15,14.99 270 top
PD1Y  46.74,14.99 270 top
PD2Y  52.32,14.99 270 top
PD3R  57.91,14.99 270 top
R1  64.26,13.72 270 top
R2  66.8,13.72 270 top
R3  69.34,13.72 270 top
R4  71.88,13.72 270 top
RSET  89.66,4.32 0 top
SW1  68.12,6.58 0 top
TEMP0G  149.86,16.51 0 top
TEMP0R  149.86,21.34 0 top
TEMP1G  156.72,16.51 0 top
TEMP1R  156.72,21.34 0 top
TEMP2G  163.58,16.51 0 top
TEMP2R  163.58,21.59 0 top
U$2  122.17,63.5 180 top

### Tracks (layer width: path | path; a pad name or v marks a point on that pad's centre or on a via)
GND  (via drill 0.35, 0.8)
  Top 0.152: MAX6955.16 85.67,11.61 | 85.67,11.61 79.51,17.77 LED4.C LED3.C LED2.C LED1.C | AD0.1 82.11,11.61 85.67,11.61
  Top 0.508: MAX6955.16 89.48,11.61 v89.66,11.43 89.66,10.67 89.01,10.02 MAX6955.18 | v118.36,24.89 118.36,48.9 v111.12,56.13
  Bottom 0.152: C2.2 107.37,13.77 LS1.+ | AD0.1 AD1.1
  Bottom 0.508: v118.36,24.89 118.36,15.24 110.36,7.24 C2.2 97.92,4.32 RSET.2 94.74,4.32 C1.1 89.66,9.4 v89.66,11.43
  pour Bottom (no thermals): 114.43,62.61 107.95,62.61 107.95,57.28 109.35,55.88 113.03,55.88 114.43,57.28
  pour Top (no thermals): 107.95,57.28 109.35,55.88 113.03,55.88 114.43,57.28 114.43,62.23 107.95,62.23
N$1
  Top 0.152: LED1.A R1.1
N$2  (via drill 0.2, 0.8)
  Top 0.152: v82.56,23.13 85.28,20.41 MAX6955.5 | U$2.SCL_ESC 52.77,26.35 v52.83,26.16
  Bottom 0.152: v52.83,26.16 55.63,23.11 82.32,23.11 v82.56,23.13
N$3
  Top 0.152: LED2.A R2.1
N$4  (via drill 0.2)
  Top 0.152: MAX6955.1 85.08,23.61 v84.84,23.37 | R1.2 64.31,12.81 SW1.8
  Bottom 0.152: SW1.8 64.26,10.39 66.57,12.7 71.12,12.7 73.66,15.24 76.71,15.24 v84.84,23.37
N$5  (via drill 0.2)
  Top 0.152: R2.2 66.85,12.81 SW1.7 | MAX6955.2 85.81,22.81 v85.6,22.61
  Bottom 0.152: SW1.7 66.85,10.72 68.07,11.94 71.12,11.94 71.75,12.57 71.79,12.61 73.91,14.73 77.72,14.73 v85.6,22.61
N$6
  Top 0.152: MAX6955.34 95.93,22.02 91.44,17.53 91.44,10.16 89.92,8.64 71.17,8.64 69.39,10.41 | R3.2 69.39,12.81 69.39,10.41 | 69.39,10.41 SW1.6
N$7
  Top 0.152: MAX6955.35 95.71,22.81 90.93,18.03 90.93,10.67 89.41,9.14 73.18,9.14 SW1.5 71.93,12.81 R4.2
N$8
  Top 0.152: MAX6955.36 102.39,23.61 LS1.-
N$9
  Top 0.152: LED3.A R3.1
N$10
  Top 0.152: LED4.A R4.1
N$11  (via drill 0.2)
  Top 0.152: v86.36,21.84 86.53,22.02 MAX6955.3
  Bottom 0.152: AD0.2 78.74,14.22 v86.36,21.84
N$12  (via drill 0.2)
  Top 0.152: v85.6,19.56 87.6,19.56 MAX6955.6
  Bottom 0.152: AD1.2 80.01,7.87 80.01,13.97 v85.6,19.56
N$13
  Top 0.152: MAX6955.20 96.16,10.81 93.73,8.38 C1.2
N$15  (via drill 0.2)
  Top 0.152: v56.13,35.69 56.13,25.53 61.85,19.81 78.23,19.81 85.63,12.41 MAX6955.15 | v29.46,35.69 29.46,27.53 DIGIT_1_RED.1 28.98,19.79 DEP4B.A | v4.06,35.69 4.06,26.9 DIGIT_0_RED.1 | v63.75,35.69 63.75,26.9 DIGIT_4_YELL0.1 | v88.52,35.69 88.52,26.9 DIGIT_5_YELL0.1 | v123.44,35.69 123.44,26.9 DIGIT_2_GREEN.1 | v147.83,35.69 147.83,27.33 DIGIT_3_GREEN.1 | HUM2R.A 137.16,27.79 137.11,27.84 137.11,31.85 136.45,32.51 v136.45,35.69
  Bottom 0.152: v4.06,35.69 v29.46,35.69 v56.13,35.69 v63.75,35.69 v88.52,35.69 v123.44,35.69 v136.45,35.69 v147.83,35.69
N$20  (via drill 0.2)
  Top 0.152: v61.21,40.77 61.21,25.53 61.85,24.89 79.25,24.89 85.33,18.81 MAX6955.7 | DIGIT_0_RED.14 DIGIT_0_RED.13 17.4,41.5 v17.4,40.77 | v128.52,40.77 128.52,41.94 DIGIT_2_GREEN.16 | v153.54,40.77 153.54,41.94 DIGIT_3_GREEN.16 | v68.2,40.77 68.73,41.3 DIGIT_4_YELL0.16 | DIGIT_5_YELL0.16 93.6,41.94 v93.6,40.77 | HUM0R.A 123.44,24.64 121.67,26.42 v121.67,40.77 | DEP0B.A 5.33,18.8 v5.33,40.77
  Bottom 0.152: v153.54,40.77 v128.52,40.77 v121.67,40.77 v93.6,40.77 v68.2,40.77 v61.21,40.77 v17.4,40.77 v5.33,40.77
N$21  (via drill 0.2)
  Top 0.152: DIGIT_1_RED.14 DIGIT_1_RED.13 42.16,41.5 v42.16,40.13 | v60.58,40.13 60.58,25.53 61.85,24.26 79.12,24.26 85.36,18.02 MAX6955.8
  Bottom 0.152: v60.58,40.13 v42.16,40.13
N$22  (via drill 0.2)
  Top 0.152: v59.94,39.5 59.94,25.53 61.85,23.62 78.99,23.62 85.34,17.27 87.6,17.27 MAX6955.9 | DIGIT_0_RED.16 9.14,41.94 v9.14,39.5 10.16,38.48 10.16,18.54 DEP1B.A | v33.91,39.5 33.91,41.94 DIGIT_1_RED.16 | v71.37,39.5 71.37,41.94 DIGIT_4_YELL0.15 | DIGIT_5_YELL0.15 96.14,41.94 v96.14,39.5 | v133.6,39.5 133.6,41.94 DIGIT_2_GREEN.14 DIGIT_2_GREEN.13 | HUM0G.A 124.64,17.7 v124.64,39.5
  Bottom 0.152: v9.14,39.5 v33.91,39.5 v59.94,39.5 v71.37,39.5 v96.14,39.5 v124.64,39.5 v133.6,39.5
N$23  (via drill 0.2)
  Top 0.152: v59.31,38.86 59.31,25.53 61.85,22.99 78.87,22.99 85.44,16.41 MAX6955.10 | DIGIT_3_GREEN.13 DIGIT_3_GREEN.14 158.62,41.94 v158.62,38.86 | v68.2,38.86 68.2,27.33 DIGIT_4_YELL0.3 | v93.6,38.86 93.6,26.9 DIGIT_5_YELL0.3 | HUM1R.A 130.3,25.4 129.74,25.96 v129.74,38.86 | DEP2B.A 18.03,18.29 v18.03,38.86
  Bottom 0.152: v158.62,38.86 v129.74,38.86 v93.6,38.86 v68.2,38.86 v59.31,38.86 v18.03,38.86
N$26  (via drill 0.2)
  Top 0.152: v58.67,38.23 58.67,25.53 61.85,22.35 78.74,22.35 85.48,15.61 MAX6955.11 | DIGIT_4_YELL0.13 DIGIT_4_YELL0.14 73.91,41.94 v73.91,38.23 | v11.68,38.23 11.68,41.94 DIGIT_0_RED.15 | v36.45,38.23 36.45,41.94 DIGIT_1_RED.15 | v131.06,38.23 131.06,41.94 DIGIT_2_GREEN.15 | v156.08,38.23 156.08,41.94 DIGIT_3_GREEN.15 | HUM1G.A 131.5,17.8 131.5,25.35 132.18,26.04 v132.18,38.23 | DEP3B.A 25.91,19.56 v25.91,38.23
  Bottom 0.152: v11.68,38.23 v25.91,38.23 v36.45,38.23 v58.67,38.23 v73.91,38.23 v131.06,38.23 v132.18,38.23 v156.08,38.23
N$27  (via drill 0.2)
  Top 0.152: v58.04,37.59 58.04,25.53 61.85,21.72 78.61,21.72 85.52,14.81 MAX6955.12 | DIGIT_5_YELL0.13 DIGIT_5_YELL0.14 98.68,41.94 v98.68,37.59 | v9.14,37.59 9.14,26.9 DIGIT_0_RED.3 | v33.91,37.59 33.91,26.9 DIGIT_1_RED.3 | v128.52,37.59 128.52,26.9 DIGIT_2_GREEN.3 | v153.54,37.59 153.54,26.9 DIGIT_3_GREEN.3 152.76,26.8 150.01,24.05 150.01,17.83 TEMP0G.A
  Bottom 0.152: v9.14,37.59 v33.91,37.59 v58.04,37.59 v98.68,37.59 v128.52,37.59 v153.54,37.59 | DIGIT_1_RED.3 32.77,25.75 32.77,17.78 42.42,8.13 GP2.A
N$29  (via drill 0.2)
  Top 0.152: v117.09,28.07 117.09,26.16 103.35,12.41 MAX6955.22 | v27.56,28.07 27.56,40.87 DIGIT_1_RED.18 | v2.79,28.07 2.79,40.23 DIGIT_0_RED.18 | v65.66,28.07 65.66,40.03 DIGIT_4_YELL0.18 | v125.35,28.07 125.35,40.03 DIGIT_2_GREEN.18 | v148.46,28.07 148.46,41.94 DIGIT_3_GREEN.18 | HUM2G.A 138.51,17.86 138.51,24.89 139.88,26.26 v139.88,28.07 | v87.25,28.07 87.25,40.87 DIGIT_5_YELL0.18
  Bottom 0.152: v27.56,28.07 v65.66,28.07 v87.25,28.07 v117.09,28.07 v125.35,28.07 v139.88,28.07 v148.46,28.07 | v27.56,28.07 v2.79,28.07 | v27.56,28.07 26.92,27.43 26.92,9.65 GP0.A
N$30  (via drill 0.2)
  Top 0.152: v116.46,28.7 116.46,26.16 103.51,13.21 MAX6955.23 | v125.98,28.7 125.98,41.94 DIGIT_2_GREEN.17 | DIGIT_5_YELL0.17 91.69,41.3 v91.69,28.7 | v66.93,28.7 66.93,41.3 DIGIT_4_YELL0.17 | DIGIT_1_RED.17 32,41.3 v32,28.7 | v7.24,28.7 7.24,41.3 DIGIT_0_RED.17 | DIGIT_3_GREEN.17 151,41.94 v151,28.7 | TEMP0R.A 148.59,24.56 146.58,26.57 v146.58,28.7 | v30,28.7 30,26.65 32,24.64 32,14.48 GP1.A
  Bottom 0.152: v7.24,28.7 v30,28.7 v32,28.7 v66.93,28.7 v91.69,28.7 v116.46,28.7 v125.98,28.7 v146.58,28.7 v151,28.7
N$31  (via drill 0.2)
  Top 0.152: v115.82,29.34 115.82,26.16 103.68,14.02 MAX6955.24 | v105.03,29.34 105.03,40.67 DIGIT_5_YELL0.11 | DIGIT_2_GREEN.11 141.22,41.94 v141.22,29.34 | DIGIT_3_GREEN.11 165.61,41.3 v165.61,29.34 | DIGIT_4_YELL0.11 82.17,41.5 v82.17,29.34 | DIGIT_1_RED.11 47.24,41.5 v47.24,29.34 | DIGIT_0_RED.11 22.48,41.5 v22.48,29.34 | TEMP1R.A 154.81,21.97 v154.81,29.34
  Bottom 0.152: v165.61,29.34 v154.81,29.34 v141.22,29.34 v115.82,29.34 v105.03,29.34 v82.17,29.34 v47.24,29.34 v22.48,29.34
N$32  (via drill 0.2)
  Top 0.152: v115.19,29.97 115.19,26.16 103.84,14.81 99.65,14.81 99.57,14.81 MAX6955.25 | v110.11,29.97 110.11,40.87 DIGIT_5_YELL0.10 | v143.76,29.97 143.76,41.94 DIGIT_2_GREEN.10 | DIGIT_3_GREEN.10 168.78,41.94 v168.78,29.97 | DIGIT_4_YELL0.10 84.71,41.5 v84.71,29.97 | DIGIT_1_RED.10 49.78,41.5 v49.78,29.97 | DIGIT_0_RED.10 25.02,41.5 v25.02,29.97 | TEMP1G.A 156.72,17.83 156.72,22.1 157.33,22.71 v157.33,29.97
  Bottom 0.152: v168.78,29.97 v157.33,29.97 v143.76,29.97 v115.19,29.97 v110.11,29.97 v84.71,29.97 v49.78,29.97 v25.02,29.97
N$33  (via drill 0.2)
  Top 0.152: v57.4,36.96 57.4,25.53 61.85,21.08 78.49,21.08 85.55,14.02 MAX6955.13 | DIGIT_0_RED.2 6.5,36.86 v6.6,36.96 | v31.37,36.96 31.37,26.9 | 31.37,26.9 31.32,26.85 DIGIT_1_RED.2 | v66.29,36.96 66.29,26.9 DIGIT_4_YELL0.2 | v91.06,36.96 91.06,26.9 DIGIT_5_YELL0.2 | DIGIT_2_GREEN.2 126.62,27.53 v126.62,36.96 | DIGIT_3_GREEN.2 150.37,27.33 v150.37,36.96 | PD0G.K PD1Y.K PD2Y.K PD3R.K | 41.15,14.38 PD0G.K | PD0G.K 33.27,21.59 33.27,24.99 31.37,26.9
  Bottom 0.152: v6.6,36.96 v31.37,36.96 v57.4,36.96 v66.29,36.96 v91.06,36.96 v126.62,36.96 v150.37,36.96 | 156.95,25.43 163.65,25.43 164.85,24.23 TEMP2R.K TEMP2G.K | 156.95,25.43 152.28,25.43 | 152.28,25.43 DIGIT_3_GREEN.2 | 152.28,25.43 150.24,25.43 | 150.24,25.43 138.38,25.43 | 138.38,25.43 131.67,25.43 | 131.67,25.43 127.26,25.43 | 127.26,25.43 DIGIT_2_GREEN.2 | 127.26,25.43 125.98,24.15 HUM0R.K HUM0G.K | 150.24,25.43 151.13,24.54 TEMP0R.K TEMP0G.K | 138.38,25.43 139.7,24.11 HUM2R.K HUM2G.K | 131.67,25.43 132.84,24.26 HUM1R.K HUM1G.K | 156.95,25.43 157.99,24.38 TEMP1R.K TEMP1G.K
N$34  (via drill 0.2)
  Top 0.152: v113.92,31.24 113.92,26.16 104.17,16.41 MAX6955.27 | v101.22,31.24 DIGIT_5_YELL0.6 | DIGIT_2_GREEN.6 136.14,26.9 v136.14,31.24 | v161.16,31.24 161.16,26.9 DIGIT_3_GREEN.6 161.06,21.13 162.31,19.89 TEMP2G.A | v76.45,31.24 76.45,26.9 DIGIT_4_YELL0.6 | DIGIT_1_RED.6 41.53,26.9 v41.53,31.24 | v16.76,31.24 16.76,26.9 DIGIT_0_RED.6
  Bottom 0.152: v161.16,31.24 v136.14,31.24 v113.92,31.24 v101.22,31.24 v76.45,31.24 v41.53,31.24 v16.76,31.24
N$35  (via drill 0.2)  (1 unrouted)
  Top 0.152: v113.28,31.88 113.28,26.16 104.39,17.27 97.21,17.27 MAX6955.28 | v14.22,31.88 14.22,26.9 DIGIT_0_RED.5 | v38.99,31.88 38.99,26.9 | v73.91,31.88 73.91,26.9 DIGIT_4_YELL0.5 | v98.68,31.88 98.68,26.9 DIGIT_5_YELL0.5 | v133.6,31.88 133.6,26.9 DIGIT_2_GREEN.5 | DIGIT_3_GREEN.5 158.62,26.9 v158.62,31.88 | 39.14,25.68 DIGIT_1_RED.5 39.14,18.26 PD0G.A
  Bottom 0.152: v14.22,31.88 v38.99,31.88 v73.91,31.88 v98.68,31.88 v113.28,31.88 v133.6,31.88 v158.62,31.88
N$36  (via drill 0.2)
  Top 0.152: v112.65,32.51 112.65,26.16 104.52,18.03 97.17,18.03 MAX6955.29 | v103.12,32.51 103.12,41.3 DIGIT_5_YELL0.12 | v138.68,32.51 138.68,41.94 DIGIT_2_GREEN.12 | v164.34,32.51 164.34,41.5 DIGIT_3_GREEN.12 | DIGIT_4_YELL0.12 79.63,41.5 v79.63,32.51 | DIGIT_1_RED.12 44.7,41.5 v44.7,32.51 | DIGIT_0_RED.12 19.94,41.5 v19.94,32.51 | PD1Y.A 40.39,22.61 v40.39,32.51
  Bottom 0.152: v164.34,32.51 v138.68,32.51 v112.65,32.51 v103.12,32.51 v79.63,32.51 v44.7,32.51 v40.39,32.51 v19.94,32.51
N$37  (via drill 0.2)
  Top 0.152: v112.01,33.15 112.01,26.16 104.67,18.81 MAX6955.30 | v78.99,33.15 78.89,33.05 DIGIT_4_YELL0.7 | v137.41,33.15 137.41,27.97 DIGIT_2_GREEN.7 | v44.07,33.15 44.07,26.9 DIGIT_1_RED.7 44.22,24.36 PD2Y.A | v19.3,33.15 19.3,26.9 DIGIT_0_RED.7 | v104.39,33.15 104.39,27.53 DIGIT_5_YELL0.7 | DIGIT_3_GREEN.7 163.7,26.9 v163.7,33.15
  Bottom 0.152: v19.3,33.15 v44.07,33.15 v78.99,33.15 v104.39,33.15 v112.01,33.15 v137.41,33.15 v163.7,33.15
N$38  (via drill 0.2)
  Top 0.152: v111.38,33.78 111.38,26.16 104.83,19.61 MAX6955.31 | v108.84,33.78 108.84,26.9 DIGIT_5_YELL0.9 | DIGIT_4_YELL0.9 84.07,26.9 v84.07,33.78 | v49.15,33.78 49.15,26.9 DIGIT_1_RED.9 49.3,24.86 PD3R.A | DIGIT_0_RED.9 24.38,26.9 v24.38,33.78 | v143.13,33.78 143.13,27.33 DIGIT_2_GREEN.9 | v168.15,33.78 168.15,27.33 DIGIT_3_GREEN.9
  Bottom 0.152: v24.38,33.78 v49.15,33.78 v84.07,33.78 v108.84,33.78 v111.38,33.78 v143.13,33.78 v168.15,33.78
N$40  (via drill 0.2)
  Top 0.152: v114.55,30.61 114.55,26.16 104.01,15.61 99.69,15.61 99.57,15.61 MAX6955.26 | v106.93,30.61 106.93,27.53 DIGIT_5_YELL0.8 | DIGIT_4_YELL0.8 81.53,26.9 v81.53,30.61 | DIGIT_1_RED.8 46.61,26.9 v46.61,30.61 | DIGIT_0_RED.8 21.84,26.9 v21.84,30.61 | DIGIT_2_GREEN.8 140.59,27.33 v140.59,30.61 | v166.24,30.61 166.24,26.9 DIGIT_3_GREEN.8 166.14,25.43 TEMP2R.A
  Bottom 0.152: v21.84,30.61 v46.61,30.61 v81.53,30.61 v106.93,30.61 v114.55,30.61 v140.59,30.61 v166.24,30.61
N$43  (via drill 0.2, 0.8)
  Top 0.152: v81.79,23.88 82.8,23.88 85.47,21.21 MAX6955.4 | U$2.SDA_ESC 55.31,26.35 v55.12,26.16
  Bottom 0.152: v55.12,26.16 57.15,23.88 v81.79,23.88
N$46  (via drill 0.2)
  Top 0.152: MAX6955.17 86.25,10.81 v86.11,10.67
  Bottom 0.152: 85.85,10.67 v86.11,10.67 86.11,7.11 RSET.1
N$56  (via drill 0.2)
  Top 0.152: v56.77,36.32 56.77,25.53 61.85,20.45 78.36,20.45 85.59,13.21 MAX6955.14 | v11.68,36.32 11.58,36.22 DIGIT_0_RED.4 11.58,21.18 DEP2B.K | v36.45,36.32 36.45,26.9 DIGIT_1_RED.4 | v71.37,36.32 71.37,26.9 DIGIT_4_YELL0.4 | v96.14,36.32 96.14,26.9 DIGIT_5_YELL0.4 | v131.06,36.32 131.06,26.9 DIGIT_2_GREEN.4 | v156.08,36.32 156.08,26.9 DIGIT_3_GREEN.4 | DEP0B.K DEP1B.K DEP2B.K | DEP2B.K DEP3B.K DEP4B.K
  Bottom 0.152: v156.08,36.32 v131.06,36.32 v96.14,36.32 v71.37,36.32 v56.77,36.32 v36.45,36.32 v11.68,36.32 | GP2.K GP1.K | GP1.K GP0.K | GP1.K 30.73,13.21 DEP4B.K
VCC  (via drill 0.35)
  Top 0.152: AD1.3 76.2,4.8 78.23,2.77
  Top 0.254: SW1.1 SW1.2 SW1.3 SW1.4 78.23,2.77 91.81,2.77 99.06,10.02
  Top 0.508: MAX6955.21 99.26,11.61 C2.1 | C2.1 100.82,10.02 99.06,10.02 MAX6955.19 | C2.1 110.22,10.03 119.63,19.45 119.63,55.63 v118.87,56.39
  Bottom 0.152: AD1.3 AD0.3
  pour Top (no thermals): 115.57,62.74 115.57,57.28 116.97,55.88 120.65,55.88 122.05,57.28 122.05,62.74
  pour Bottom (no thermals): 115.57,62.61 115.57,57.28 116.71,56.13 120.9,56.13 122.05,57.28 122.05,62.61
(copper drawn outside any net)
  shapes: Top area x3

### Text on the board
tNames: The Ohio State University / Center For Automotive Research | Status Board -- Rev 1.0 / Anthony Condo | ^_^ | :P | R | HUM0 | HUM1 | HUM2 | TEMP0 | TEMP1 | TEMP2 | DEP0 | B | DEP1 | DEP2 | DEP3 | DEP4 | G | PD0G | PD1Y | PD2Y | PD3R